# Altium schematic sheet Bottom_Port.SchDoc
size A4; SheetNumber: 8; SheetTotal: 8
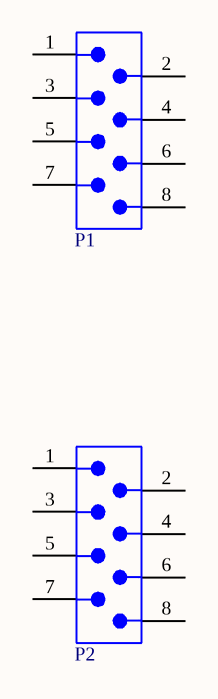
[diagram p0: Bottom_Port.SchDoc]

## Parts
P1  690357280876  [690357280876]  (value not drawn)
P2  690357280876  [690357280876]  (value not drawn)

## Nets

Not connected (* = marked no-connect by the designer): P1 1 2 3 4 5 6 7 8; P2 1 2 3 4 5 6 7 8

## Library data of the parts
P1 P2 = 690357280876: WR-MM Mini Module Connector, Male, SMT, without Latch & Polarization, Straight, pitch 2.54mm, 8p; Manufacturer: Wurth Elektronik; Contact Resistance: 10mΩ; Insulation Resistance: 1000MΩ; Rated Current: 1.5A; Working Voltage: 250VAC; Withstanding Voltage: 500VAC; ComponentLink1Description: Website Link; ComponentLink1URL: https://www.we-online.com/redexpert/article/690357280876?ad; ComponentLink2Description: Datasheet Link; ComponentLink2URL: https://www.we-online.com/redexpert/spec/690357280876?ad; Manufacturer Part Number: 690357280876; Category: Board-to-Board Connectors; Match Code: WR-MM; Mount: Surface Mount; Operating Temperature Max: 105°C; Operating Temperature Min: -40°C; Packaging: Tape and Reel; Length: 12.19mm; Gender: Male; Number of Pins: 8; Orientation: Straight; Pitch: 2.54mm